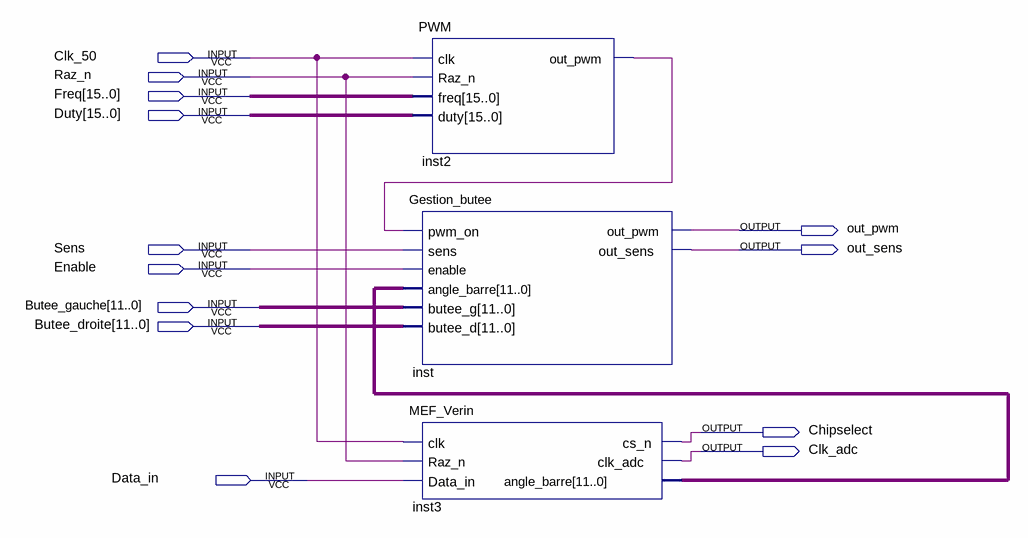
[diagram p0: schematic sheet]
// Quartus schematic Verin.bdf as structural Verilog: 3 symbols, 13 pins
module Verin (
  input  Clk_50,
  input  Raz_n,
  input  [15:0] Freq,
  input  [15:0] Duty,
  input  Sens,
  input  Enable,
  input  [11:0] Butee_gauche,
  input  [11:0] Butee_droite,
  input  Data_in,
  output out_pwm,
  output out_sens,
  output Chipselect,
  output Clk_adc
);

  wire inst2_out_pwm;
  wire [11:0] inst3_angle_barre;

  PWM inst2 (.clk(Clk_50), .Raz_n(Raz_n), .freq(Freq), .duty(Duty), .out_pwm(inst2_out_pwm));
  Gestion_butee inst (
    .pwm_on(inst2_out_pwm), .sens(Sens), .enable(Enable), .angle_barre(inst3_angle_barre),
    .butee_g(Butee_gauche), .butee_d(Butee_droite), .out_pwm(out_pwm), .out_sens(out_sens));
  MEF_Verin inst3 (
    .clk(Clk_50), .Raz_n(Raz_n), .Data_in(Data_in), .cs_n(Chipselect), .clk_adc(Clk_adc),
    .angle_barre(inst3_angle_barre));
endmodule
